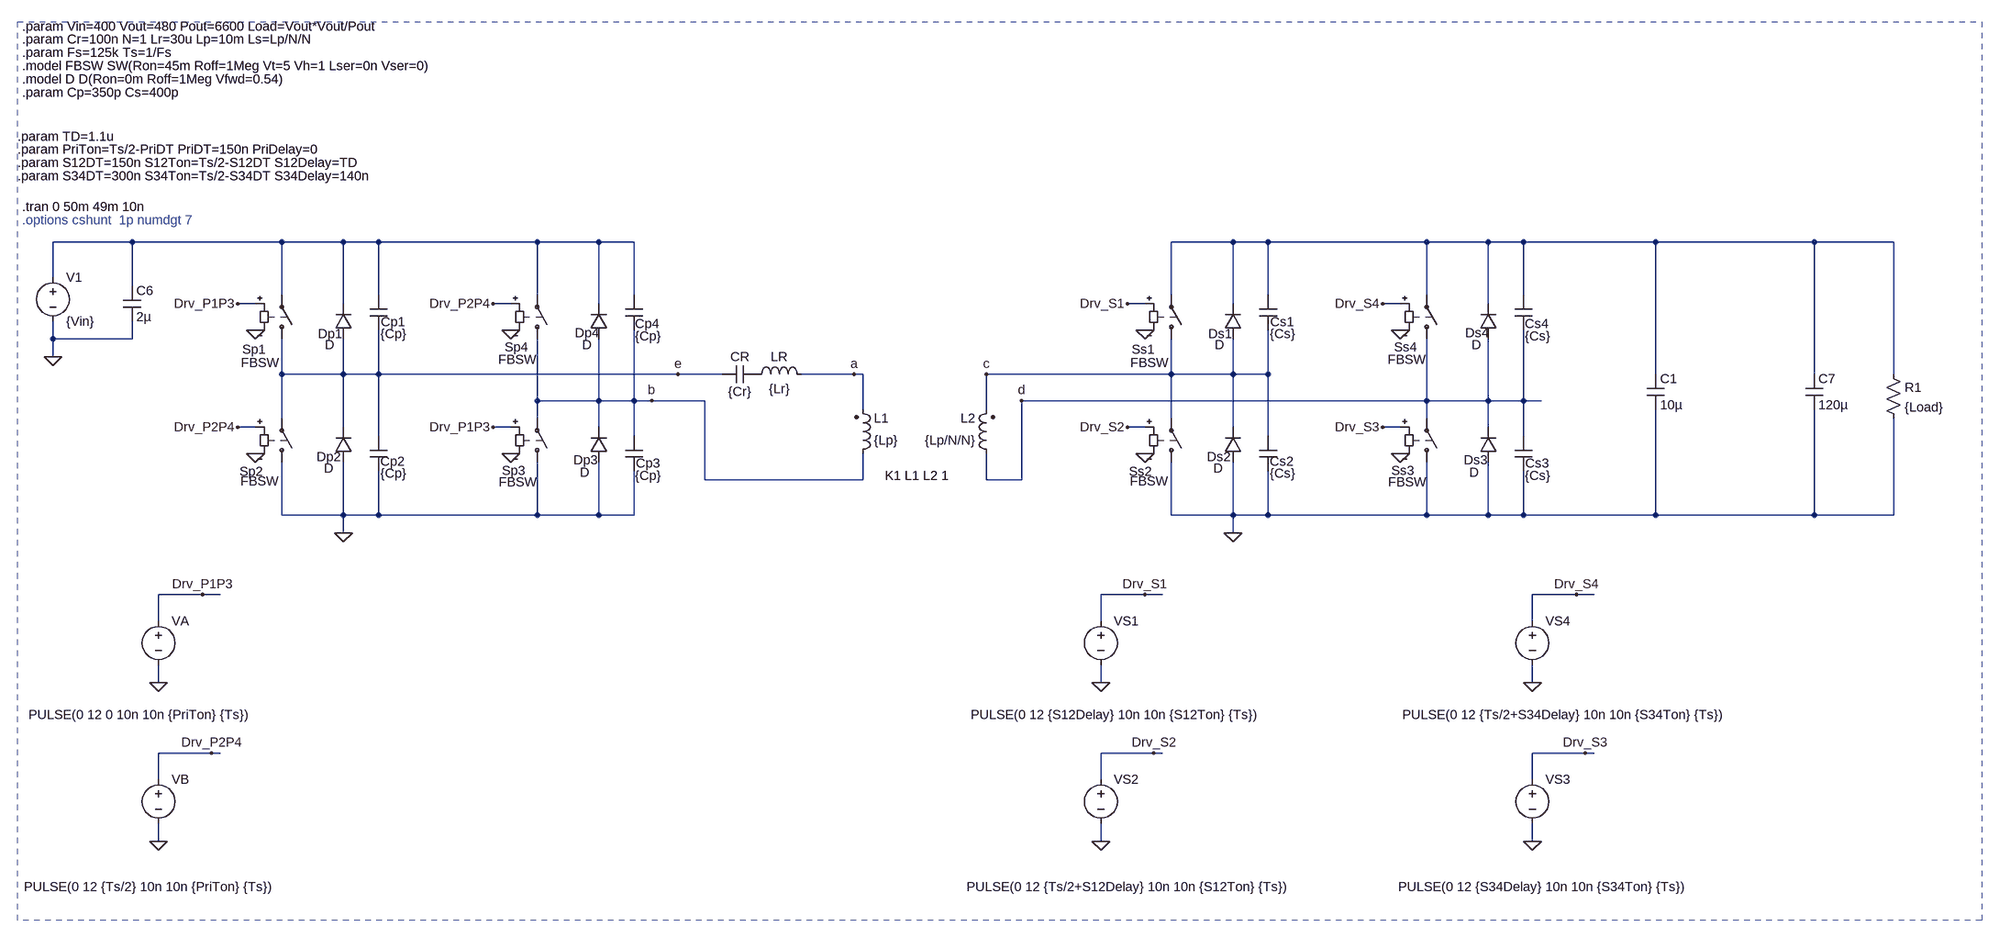
[diagram p0: schematic 6600 DAB - 480V 6600W.asc]
6600 DAB - 480V 6600W.asc, the LTspice schematic file:
Version 4
SHEET 1 2960 2756
WIRE -496 -112 -640 -112
WIRE -224 -112 -496 -112
WIRE -112 -112 -224 -112
WIRE -48 -112 -112 -112
WIRE 240 -112 -48 -112
WIRE 352 -112 240 -112
WIRE 416 -112 352 -112
WIRE 1504 -112 1392 -112
WIRE 1568 -112 1504 -112
WIRE 1856 -112 1568 -112
WIRE 1968 -112 1856 -112
WIRE 2032 -112 1968 -112
WIRE 2272 -112 2032 -112
WIRE 2560 -112 2272 -112
WIRE 2704 -112 2560 -112
WIRE -640 -48 -640 -112
WIRE -496 -32 -496 -112
WIRE -224 -16 -224 -112
WIRE -48 -16 -48 -112
WIRE 240 -16 240 -112
WIRE 416 -16 416 -112
WIRE 1392 -16 1392 -112
WIRE 1568 -16 1568 -112
WIRE 1856 -16 1856 -112
WIRE 2032 -16 2032 -112
WIRE -272 0 -304 0
WIRE -112 0 -112 -112
WIRE 192 0 160 0
WIRE 352 0 352 -112
WIRE 1344 0 1312 0
WIRE 1504 0 1504 -112
WIRE 1808 0 1776 0
WIRE 1968 0 1968 -112
WIRE -640 64 -640 32
WIRE -496 64 -496 32
WIRE -496 64 -640 64
WIRE -640 96 -640 64
WIRE -224 128 -224 64
WIRE -112 128 -112 64
WIRE -112 128 -224 128
WIRE -48 128 -48 48
WIRE -48 128 -112 128
WIRE 496 128 -48 128
WIRE 576 128 496 128
WIRE 816 128 720 128
WIRE 832 128 816 128
WIRE 1392 128 1392 64
WIRE 1392 128 1056 128
WIRE 1504 128 1504 64
WIRE 1504 128 1392 128
WIRE 1568 128 1568 48
WIRE 1568 128 1504 128
WIRE 2272 128 2272 -112
WIRE 2560 128 2560 -112
WIRE 2704 128 2704 -112
WIRE 240 176 240 64
WIRE 352 176 352 64
WIRE 352 176 240 176
WIRE 416 176 416 48
WIRE 416 176 352 176
WIRE 448 176 416 176
WIRE 544 176 448 176
WIRE 1856 176 1856 64
WIRE 1856 176 1120 176
WIRE 1968 176 1968 64
WIRE 1968 176 1856 176
WIRE 2032 176 2032 48
WIRE 2032 176 1968 176
WIRE 2064 176 2032 176
WIRE 832 192 832 128
WIRE 1056 192 1056 128
WIRE -224 208 -224 128
WIRE 240 208 240 176
WIRE 1392 208 1392 128
WIRE 1856 208 1856 176
WIRE -272 224 -304 224
WIRE -112 224 -112 128
WIRE 192 224 160 224
WIRE 352 224 352 176
WIRE 1344 224 1312 224
WIRE 1504 224 1504 128
WIRE 1808 224 1776 224
WIRE 1968 224 1968 176
WIRE -48 240 -48 128
WIRE 416 240 416 176
WIRE 1568 240 1568 128
WIRE 2032 240 2032 176
WIRE 544 320 544 176
WIRE 832 320 832 272
WIRE 832 320 544 320
WIRE 1056 320 1056 272
WIRE 1120 320 1120 176
WIRE 1120 320 1056 320
WIRE -224 384 -224 288
WIRE -112 384 -112 288
WIRE -112 384 -224 384
WIRE -48 384 -48 304
WIRE -48 384 -112 384
WIRE 240 384 240 288
WIRE 240 384 -48 384
WIRE 352 384 352 288
WIRE 352 384 240 384
WIRE 416 384 416 304
WIRE 416 384 352 384
WIRE 1392 384 1392 288
WIRE 1504 384 1504 288
WIRE 1504 384 1392 384
WIRE 1568 384 1568 304
WIRE 1568 384 1504 384
WIRE 1856 384 1856 288
WIRE 1856 384 1568 384
WIRE 1968 384 1968 288
WIRE 1968 384 1856 384
WIRE 2032 384 2032 304
WIRE 2032 384 1968 384
WIRE 2272 384 2272 192
WIRE 2272 384 2032 384
WIRE 2560 384 2560 192
WIRE 2560 384 2272 384
WIRE 2704 384 2704 208
WIRE 2704 384 2560 384
WIRE -112 416 -112 384
WIRE 1504 416 1504 384
WIRE -368 528 -448 528
WIRE -336 528 -368 528
WIRE 1344 528 1264 528
WIRE 1376 528 1344 528
WIRE 2128 528 2048 528
WIRE 2160 528 2128 528
WIRE -448 576 -448 528
WIRE 1264 576 1264 528
WIRE 2048 576 2048 528
WIRE -448 688 -448 656
WIRE 1264 688 1264 656
WIRE 2048 688 2048 656
WIRE -352 816 -448 816
WIRE -336 816 -352 816
WIRE 1360 816 1264 816
WIRE 1376 816 1360 816
WIRE 2144 816 2048 816
WIRE 2160 816 2144 816
WIRE -448 864 -448 816
WIRE 1264 864 1264 816
WIRE 2048 864 2048 816
WIRE -448 976 -448 944
WIRE 1264 976 1264 944
WIRE 2048 976 2048 944
FLAG -112 416 0
FLAG -272 48 0
FLAG -272 272 0
FLAG 192 48 0
FLAG 192 272 0
FLAG -640 96 0
FLAG -448 688 0
FLAG -368 528 Drv_P1P3
FLAG -448 976 0
FLAG -352 816 Drv_P2P4
FLAG 816 128 a
FLAG 448 176 b
FLAG 1056 128 c
FLAG 1120 176 d
FLAG 1504 416 0
FLAG 1344 48 0
FLAG 1344 272 0
FLAG 1808 48 0
FLAG 1808 272 0
FLAG 1264 688 0
FLAG 1344 528 Drv_S1
FLAG 1264 976 0
FLAG 1360 816 Drv_S2
FLAG 2048 688 0
FLAG 2128 528 Drv_S4
FLAG 2048 976 0
FLAG 2144 816 Drv_S3
FLAG -304 0 Drv_P1P3
FLAG 160 224 Drv_P1P3
FLAG -304 224 Drv_P2P4
FLAG 160 0 Drv_P2P4
FLAG 1312 0 Drv_S1
FLAG 1312 224 Drv_S2
FLAG 1776 0 Drv_S4
FLAG 1776 224 Drv_S3
FLAG 496 128 e
DATAFLAG 288 -112 ""
DATAFLAG 1856 -112 ""
SYMBOL cap 2256 128 R0
SYMATTR InstName C1
SYMATTR Value 10µ
SYMATTR SpiceLine Rser=0.224m
SYMBOL sw -224 80 M180
WINDOW 0 -72 -3 Left 2
WINDOW 3 -74 -27 Left 2
SYMATTR InstName Sp1
SYMATTR Value FBSW
SYMBOL sw -224 304 M180
WINDOW 0 -77 -1 Left 2
WINDOW 3 -75 -18 Left 2
SYMATTR InstName Sp2
SYMATTR Value FBSW
SYMBOL diode -96 64 R180
WINDOW 0 18 9 Left 2
WINDOW 3 32 -11 Left 2
SYMATTR InstName Dp1
SYMBOL diode -96 288 R180
WINDOW 0 20 10 Left 2
WINDOW 3 34 -11 Left 2
SYMATTR InstName Dp2
SYMBOL cap -64 -16 R0
WINDOW 0 20 49 Left 2
WINDOW 3 19 71 Left 2
SYMATTR InstName Cp1
SYMATTR Value {Cp}
SYMBOL cap -64 240 R0
WINDOW 0 19 46 Left 2
WINDOW 3 19 68 Left 2
SYMATTR InstName Cp2
SYMATTR Value {Cp}
SYMBOL sw 240 80 M180
WINDOW 0 -59 1 Left 2
WINDOW 3 -71 -21 Left 2
SYMATTR InstName Sp4
SYMATTR Value FBSW
SYMBOL sw 240 304 M180
WINDOW 0 -64 1 Left 2
WINDOW 3 -70 -20 Left 2
SYMATTR InstName Sp3
SYMATTR Value FBSW
SYMBOL diode 368 64 R180
WINDOW 0 15 11 Left 2
WINDOW 3 29 -11 Left 2
SYMATTR InstName Dp4
SYMBOL diode 368 288 R180
WINDOW 0 18 4 Left 2
WINDOW 3 33 -18 Left 2
SYMATTR InstName Dp3
SYMBOL cap 400 -16 R0
WINDOW 0 18 52 Left 2
WINDOW 3 18 75 Left 2
SYMATTR InstName Cp4
SYMATTR Value {Cp}
SYMBOL cap 400 240 R0
WINDOW 0 19 50 Left 2
WINDOW 3 18 72 Left 2
SYMATTR InstName Cp3
SYMATTR Value {Cp}
SYMBOL ind 624 144 R270
WINDOW 0 32 56 VTop 2
WINDOW 3 5 56 VBottom 2
SYMATTR InstName LR
SYMATTR Value {Lr}
SYMBOL cap 640 112 R90
WINDOW 0 0 32 VBottom 2
WINDOW 3 32 32 VTop 2
SYMATTR InstName CR
SYMATTR Value {Cr}
SYMBOL voltage -640 -64 R0
WINDOW 123 0 0 Left 0
WINDOW 39 0 0 Left 0
SYMATTR InstName V1
SYMATTR Value {Vin}
SYMBOL voltage -448 560 R0
WINDOW 3 -236 186 Left 2
WINDOW 123 0 0 Left 0
WINDOW 39 0 0 Left 0
SYMATTR Value PULSE(0 12 0 10n 10n {PriTon} {Ts})
SYMATTR InstName VA
SYMBOL voltage -448 848 R0
WINDOW 3 -244 211 Left 2
WINDOW 123 0 0 Left 0
WINDOW 39 0 0 Left 0
SYMATTR Value PULSE(0 12 {Ts/2} 10n 10n {PriTon} {Ts})
SYMATTR InstName VB
SYMBOL res 2688 112 R0
SYMATTR InstName R1
SYMATTR Value {Load}
SYMBOL cap -512 -32 R0
SYMATTR InstName C6
SYMATTR Value 2µ
SYMBOL ind2 816 288 M180
WINDOW 0 36 80 Left 2
WINDOW 3 36 40 Left 2
SYMATTR InstName L1
SYMATTR Value {Lp}
SYMATTR Type ind
SYMBOL ind2 1072 288 R180
WINDOW 0 36 80 Left 2
WINDOW 3 36 40 Left 2
SYMATTR InstName L2
SYMATTR Value {Lp/N/N}
SYMATTR Type ind
SYMBOL cap 2544 128 R0
SYMATTR InstName C7
SYMATTR Value 120µ
SYMATTR SpiceLine Rser=0.224m
SYMBOL sw 1392 80 M180
WINDOW 0 -72 -3 Left 2
WINDOW 3 -74 -27 Left 2
SYMATTR InstName Ss1
SYMATTR Value FBSW
SYMBOL sw 1392 304 M180
WINDOW 0 -77 -1 Left 2
WINDOW 3 -75 -18 Left 2
SYMATTR InstName Ss2
SYMATTR Value FBSW
SYMBOL diode 1520 64 R180
WINDOW 0 18 9 Left 2
WINDOW 3 32 -11 Left 2
SYMATTR InstName Ds1
SYMBOL diode 1520 288 R180
WINDOW 0 20 10 Left 2
WINDOW 3 34 -11 Left 2
SYMATTR InstName Ds2
SYMBOL cap 1552 -16 R0
WINDOW 0 20 49 Left 2
WINDOW 3 19 71 Left 2
SYMATTR InstName Cs1
SYMATTR Value {Cs}
SYMBOL cap 1552 240 R0
WINDOW 0 19 46 Left 2
WINDOW 3 19 68 Left 2
SYMATTR InstName Cs2
SYMATTR Value {Cs}
SYMBOL sw 1856 80 M180
WINDOW 0 -59 1 Left 2
WINDOW 3 -71 -21 Left 2
SYMATTR InstName Ss4
SYMATTR Value FBSW
SYMBOL sw 1856 304 M180
WINDOW 0 -64 1 Left 2
WINDOW 3 -70 -20 Left 2
SYMATTR InstName Ss3
SYMATTR Value FBSW
SYMBOL diode 1984 64 R180
WINDOW 0 15 11 Left 2
WINDOW 3 29 -11 Left 2
SYMATTR InstName Ds4
SYMBOL diode 1984 288 R180
WINDOW 0 18 4 Left 2
WINDOW 3 33 -18 Left 2
SYMATTR InstName Ds3
SYMBOL cap 2016 -16 R0
WINDOW 0 18 52 Left 2
WINDOW 3 18 75 Left 2
SYMATTR InstName Cs4
SYMATTR Value {Cs}
SYMBOL cap 2016 240 R0
WINDOW 0 19 50 Left 2
WINDOW 3 18 72 Left 2
SYMATTR InstName Cs3
SYMATTR Value {Cs}
SYMBOL voltage 1264 560 R0
WINDOW 3 -236 186 Left 2
WINDOW 123 0 0 Left 0
WINDOW 39 0 0 Left 0
SYMATTR Value PULSE(0 12 {S12Delay} 10n 10n {S12Ton} {Ts})
SYMATTR InstName VS1
SYMBOL voltage 1264 848 R0
WINDOW 3 -244 211 Left 2
WINDOW 123 0 0 Left 0
WINDOW 39 0 0 Left 0
SYMATTR Value PULSE(0 12 {Ts/2+S12Delay} 10n 10n {S12Ton} {Ts})
SYMATTR InstName VS2
SYMBOL voltage 2048 560 R0
WINDOW 3 -236 186 Left 2
WINDOW 123 0 0 Left 0
WINDOW 39 0 0 Left 0
SYMATTR Value PULSE(0 12 {Ts/2+S34Delay} 10n 10n {S34Ton} {Ts})
SYMATTR InstName VS4
SYMBOL voltage 2048 848 R0
WINDOW 3 -244 211 Left 2
WINDOW 123 0 0 Left 0
WINDOW 39 0 0 Left 0
SYMATTR Value PULSE(0 12 {S34Delay} 10n 10n {S34Ton} {Ts})
SYMATTR InstName VS3
TEXT -696 -432 Left 2 !.model FBSW SW(Ron=45m Roff=1Meg Vt=5 Vh=1 Lser=0n Vser=0)
TEXT 872 312 Left 2 !K1 L1 L2 1
TEXT -696 -176 Left 2 !.tran 0 50m 49m 10n
TEXT -696 -152 Left 2 ;.options cshunt  1p numdgt 7
TEXT -696 -408 Left 2 !.model D D(Ron=0m Roff=1Meg Vfwd=0.54)
TEXT -704 -280 Left 2 !.param PriTon=Ts/2-PriDT PriDT=150n PriDelay=0
TEXT -696 -504 Left 2 !.param Vin=400 Vout=480 Pout=6600 Load=Vout*Vout/Pout
TEXT -696 -456 Left 2 !.param Fs=125k Ts=1/Fs
TEXT -696 -480 Left 2 !.param Cr=100n N=1 Lr=30u Lp=10m Ls=Lp/N/N
TEXT -696 -384 Left 2 !.param Cp=350p Cs=400p
TEXT -704 -256 Left 2 !.param S12DT=150n S12Ton=Ts/2-S12DT S12Delay=TD
TEXT -704 -232 Left 2 !.param S34DT=300n S34Ton=Ts/2-S34DT S34Delay=140n
TEXT -704 -304 Left 2 !.param TD=1.1u
RECTANGLE Normal 2864 1120 -704 -512 1

The netlist it stands for:
* 6600 DAB - 480V 6600W.asc
C1 N002 0 10µ Rser=0.224m
Sp1 e N001 Drv_P1P3 0 FBSW
Sp2 0 e Drv_P2P4 0 FBSW
Dp1 e N001 D
Dp2 0 e D
Cp1 N001 e {Cp}
Cp2 e 0 {Cp}
Sp4 b N001 Drv_P2P4 0 FBSW
Sp3 0 b Drv_P1P3 0 FBSW
Dp4 b N001 D
Dp3 0 b D
Cp4 N001 b {Cp}
Cp3 b 0 {Cp}
LR P001 a {Lr}
CR P001 e {Cr}
V1 N001 0 {Vin}
VA Drv_P1P3 0 PULSE(0 12 0 10n 10n {PriTon} {Ts})
VB Drv_P2P4 0 PULSE(0 12 {Ts/2} 10n 10n {PriTon} {Ts})
R1 N002 0 {Load}
C6 N001 0 2µ
L1 b a {Lp}
L2 d c {Lp/N/N}
C7 N002 0 120µ Rser=0.224m
Ss1 c N002 Drv_S1 0 FBSW
Ss2 0 c Drv_S2 0 FBSW
Ds1 c N002 D
Ds2 0 c D
Cs1 N002 c {Cs}
Cs2 c 0 {Cs}
Ss4 d N002 Drv_S4 0 FBSW
Ss3 0 d Drv_S3 0 FBSW
Ds4 d N002 D
Ds3 0 d D
Cs4 N002 d {Cs}
Cs3 d 0 {Cs}
VS1 Drv_S1 0 PULSE(0 12 {S12Delay} 10n 10n {S12Ton} {Ts})
VS2 Drv_S2 0 PULSE(0 12 {Ts/2+S12Delay} 10n 10n {S12Ton} {Ts})
VS4 Drv_S4 0 PULSE(0 12 {Ts/2+S34Delay} 10n 10n {S34Ton} {Ts})
VS3 Drv_S3 0 PULSE(0 12 {S34Delay} 10n 10n {S34Ton} {Ts})
.model D D
.lib standard.dio
.model FBSW SW(Ron=45m Roff=1Meg Vt=5 Vh=1 Lser=0n Vser=0)
K1 L1 L2 1
.tran 0 50m 49m 10n
* .options cshunt  1p numdgt 7
.model D D(Ron=0m Roff=1Meg Vfwd=0.54)
.param PriTon=Ts/2-PriDT PriDT=150n PriDelay=0
.param Vin=400 Vout=480 Pout=6600 Load=Vout*Vout/Pout
.param Fs=125k Ts=1/Fs
.param Cr=100n N=1 Lr=30u Lp=10m Ls=Lp/N/N
.param Cp=350p Cs=400p
.param S12DT=150n S12Ton=Ts/2-S12DT S12Delay=TD
.param S34DT=300n S34Ton=Ts/2-S34DT S34Delay=140n
.param TD=1.1u
.backanno
.end